# EasyEDA schematic SCH_case_AmbientWatch_2025-09-15.json
TITLE: AmbientWatch; REV: 1.0; Date: 2025-07-11; Sheet: 1/1
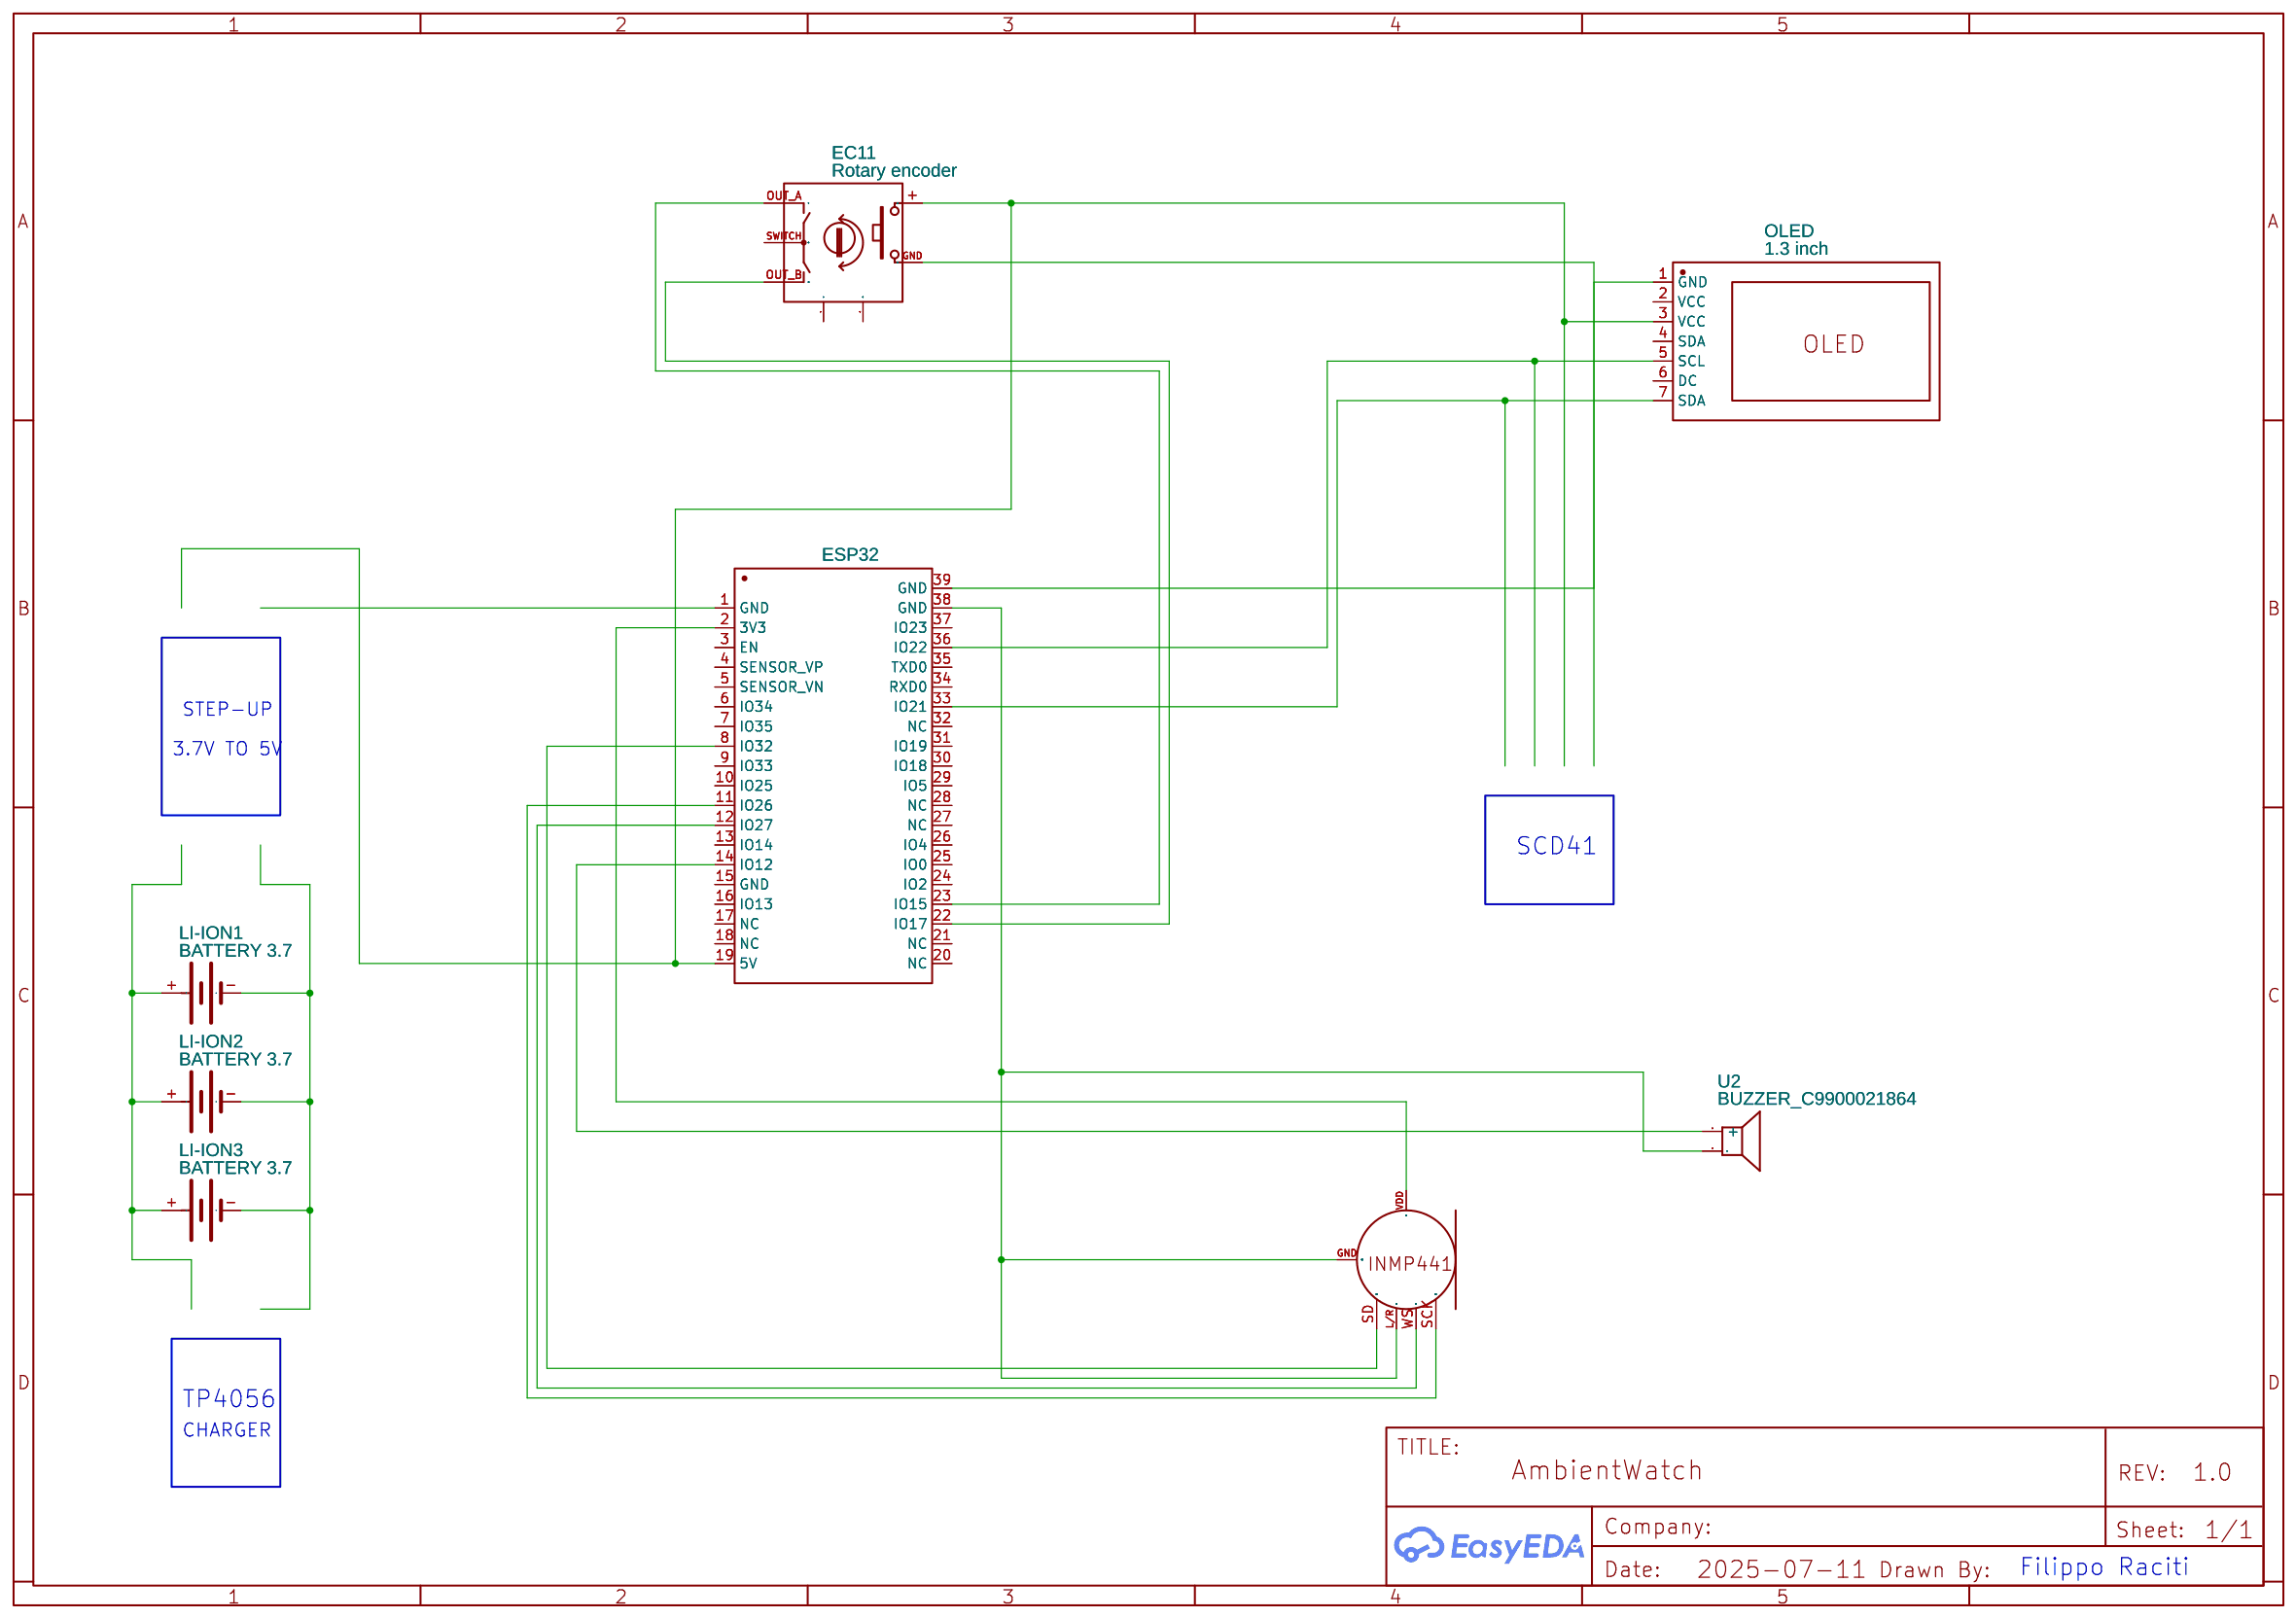
[diagram p0: schematic sheet]

## Parts
EC11  Rotary encoder  [EC11-TH_EC110201E2J-HA1-005]
LI-ION1  BATTERY 3.7  [LIPO-110-TABS]
LI-ION2  BATTERY 3.7  [LIPO-110-TABS]
LI-ION3  BATTERY 3.7  [LIPO-110-TABS]
MIC1  INMP411ACEZ-R0  [MIC-SMD_6P-L4.7-W3.8-P2.53_SPM0687LR5H-1]
OLED  1.3 inch  [OLED-TH_HS96L01B4S03]
U1  ESP32  [WIFI-SMD_ESP32-WROVER-E]
U2  BUZZER_C9900021864  [BUZ-SMD_BUZZER]

## Library data of the parts
EC11 = EC110201E2J-HA1-005: Supplier: LCSC; Supplier Part: C9900147203; Manufacturer: null; Contributor: lcsc
LI-ION1-LI-ION3 = BATTERY: Contributor: SparkFun
MIC1 = INMP411ACEZ-R0: Supplier: LCSC; Supplier Part: C19309467; Manufacturer: TDK InvenSense(应美盛); JLCPCB Part Class: Extended Part; Contributor: lcsc
OLED = HS96L01B4S03: Supplier: LCSC; Supplier Part: C5139759; Manufacturer: HS(汉昇); JLCPCB Part Class: Extended Part; Contributor: lcsc
U1 = ESP32-WROVER-E-N4R8: Contributor: lcsc; Supplier: LCSC; Supplier Part: C2973668; Manufacturer: null; JLCPCB Part Class: Extended Part
U2 = BUZZER_C9900021864: Contributor: lcsc; Supplier: LCSC; Supplier Part: C9900021864; Manufacturer: null; Manufacturer Part: BUZZER; JLCPCB Part Class: Extended Part

## Nets
Net-(EC11-+): EC11.+(E) OLED.3(VCC) U1.19(5V)
Net-(EC11-OUT A): EC11.OUT A(A) U1.23(IO15)
Net-(EC11-OUT B): EC11.OUT B(B) U1.22(IO17)
Net-(LI-ION1-+): LI-ION1.+ LI-ION2.+ LI-ION3.+
Net-(LI-ION1--): LI-ION1.- LI-ION2.- LI-ION3.-
Net-(MIC1-GND): MIC1.GND(OUTPUT) MIC1.L/R(GND) U1.38(GND) U2.1
Net-(MIC1-SCK): MIC1.SCK(GND) U1.11(IO26)
Net-(MIC1-SD): MIC1.SD(GND) U1.8(IO32)
Net-(MIC1-VDD): MIC1.VDD U1.2(3V3)
Net-(MIC1-WS): MIC1.WS(GND) U1.12(IO27)
Net-(OLED-1): OLED.1(GND) U1.39(GND)
Net-(OLED-5): OLED.5(SCL) U1.36(IO22)
Net-(OLED-7): OLED.7(SDA) U1.33(IO21)
Net-(U1-14): U1.14(IO12) U2.2(+)

Not connected (* = marked no-connect by the designer): EC11 1 2 GND(D) SWITCH(C); OLED 2(VCC) 4(SDA) 6(DC); U1 1(GND) 3(EN) 4(SENSOR_VP) 5(SENSOR_VN) 6(IO34) 7(IO35) 9(IO33) 10(IO25) 13(IO14) 15(GND) 16(IO13) 17(NC) 18(NC) 20(NC) 21(NC) 24(IO2) 25(IO0) 26(IO4) 27(NC) 28(NC) 29(IO5) 30(IO18) 31(IO19) 32(NC) 34(RXD0) 35(TXD0) 37(IO23)

## Notes on the sheet
- STEP-UP
- 3.7V TO 5V
- SCD41
- TP4056
- CHARGER
- Filippo Raciti
